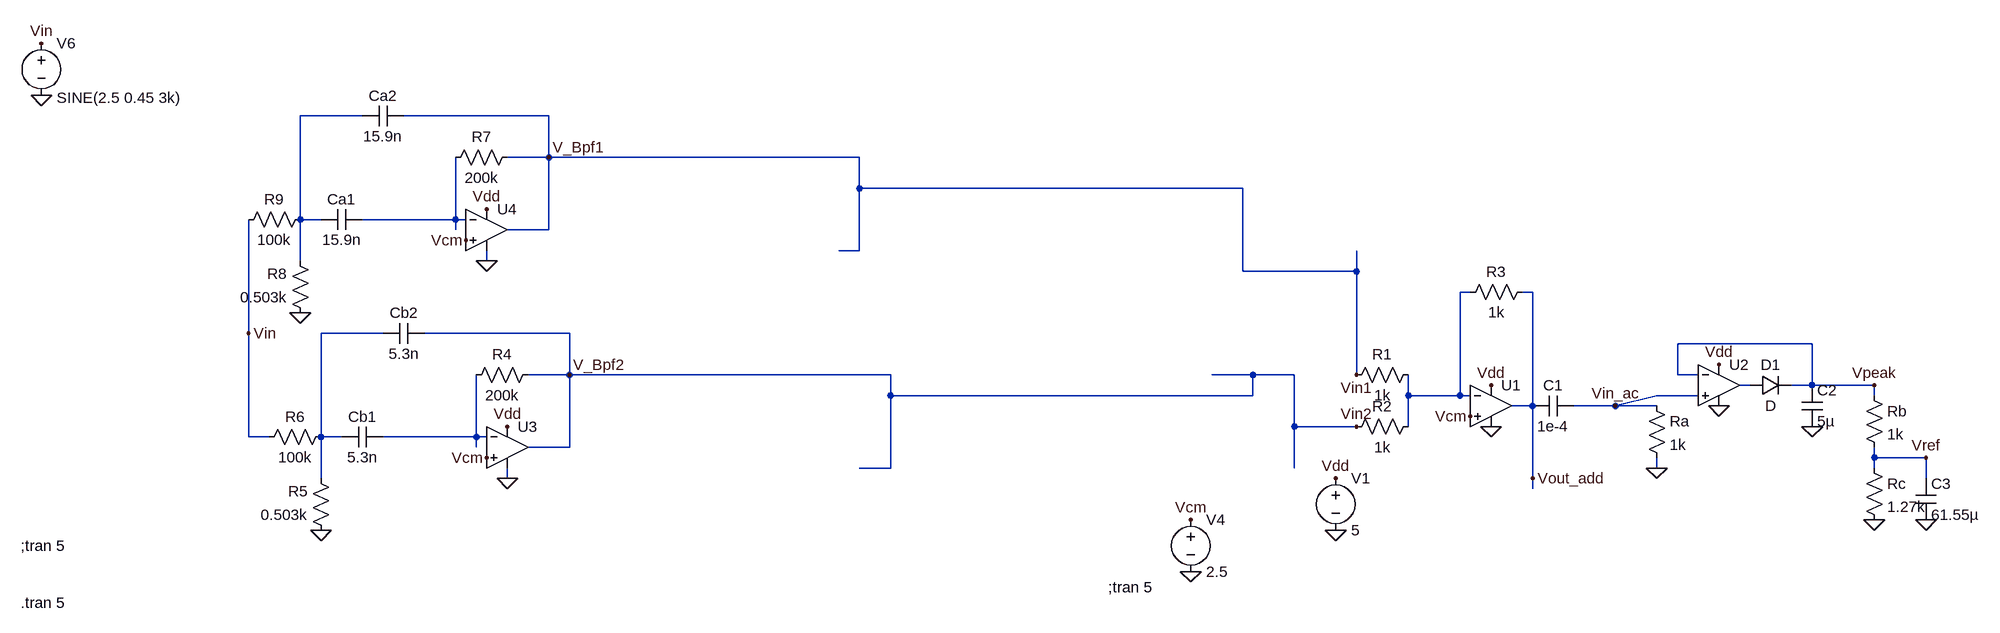
[diagram p0: schematic EE18B155_Exp7.asc]
EE18B155_Exp7.asc, the LTspice schematic file:
Version 4
SHEET 1 992 680
WIRE -1520 -352 -1616 -352
WIRE -1232 -352 -1456 -352
WIRE -1232 -288 -1232 -352
WIRE -1232 -288 -1296 -288
WIRE -752 -288 -1232 -288
WIRE -752 -240 -752 -288
WIRE -160 -240 -752 -240
WIRE -1616 -192 -1616 -352
WIRE -1584 -192 -1616 -192
WIRE -1376 -192 -1376 -288
WIRE -1376 -192 -1520 -192
WIRE -1360 -192 -1376 -192
WIRE -1376 -176 -1376 -192
WIRE -1232 -176 -1232 -288
WIRE -1232 -176 -1296 -176
WIRE -752 -144 -752 -240
WIRE -752 -144 -784 -144
WIRE -1616 -128 -1616 -192
WIRE -1328 -128 -1328 -144
WIRE -160 -112 -160 -240
WIRE 16 -112 16 -144
WIRE 16 -112 -160 -112
WIRE 192 -80 176 -80
WIRE 288 -80 272 -80
WIRE -1696 -16 -1696 -192
WIRE -1488 -16 -1584 -16
WIRE -1200 -16 -1424 -16
WIRE 720 0 512 0
WIRE -1200 48 -1200 -16
WIRE -1200 48 -1264 48
WIRE -704 48 -1200 48
WIRE -144 48 -208 48
WIRE -80 48 -144 48
WIRE 16 48 16 -112
WIRE 512 48 512 0
WIRE 544 48 512 48
WIRE 624 64 608 64
WIRE 720 64 720 0
WIRE 720 64 688 64
WIRE 816 64 720 64
WIRE -704 80 -704 48
WIRE -144 80 -144 48
WIRE -144 80 -704 80
WIRE 96 80 96 48
WIRE 176 80 176 -80
WIRE 176 80 96 80
WIRE 192 80 176 80
WIRE 544 80 480 80
WIRE 816 80 816 64
WIRE 288 96 288 -80
WIRE 288 96 256 96
WIRE 416 96 480 80
WIRE 416 96 352 96
WIRE 480 96 416 96
WIRE -80 128 -80 48
WIRE 16 128 -80 128
WIRE 96 128 96 80
WIRE -1696 144 -1696 -16
WIRE -1664 144 -1696 144
WIRE -1584 144 -1584 -16
WIRE -1552 144 -1584 144
WIRE -1344 144 -1344 48
WIRE -1344 144 -1488 144
WIRE -1328 144 -1344 144
WIRE -1344 160 -1344 144
WIRE -1200 160 -1200 48
WIRE -1200 160 -1264 160
WIRE 816 176 816 160
WIRE 896 176 816 176
WIRE -704 192 -704 80
WIRE -704 192 -752 192
WIRE -80 192 -80 128
WIRE 480 192 480 176
WIRE 816 192 816 176
WIRE -1584 208 -1584 144
WIRE -1296 208 -1296 192
WIRE 288 208 288 96
WIRE 896 208 896 176
WIRE 288 224 288 208
FLAG 224 128 0
FLAG 16 48 Vin1
FLAG 16 128 Vin2
FLAG 192 112 Vcm
FLAG 480 192 0
FLAG 576 96 0
FLAG 816 272 0
FLAG 896 272 0
FLAG 720 128 0
FLAG 896 176 Vref
FLAG 224 64 Vdd
FLAG 576 32 Vdd
FLAG -16 288 0
FLAG -16 208 Vdd
FLAG -240 352 0
FLAG -240 272 Vcm
FLAG 416 96 Vin_ac
FLAG 288 208 Vout_add
FLAG 816 64 Vpeak
FLAG -1296 208 0
FLAG -1296 128 Vdd
FLAG -1328 176 Vcm
FLAG -1584 288 0
FLAG -1328 -128 0
FLAG -1328 -208 Vdd
FLAG -1360 -160 Vcm
FLAG -1616 -48 0
FLAG -1696 -16 Vin
FLAG -1232 -288 V_Bpf1
FLAG -1200 48 V_Bpf2
FLAG -2016 -384 0
FLAG -2016 -464 Vin
SYMBOL res 112 32 R90
WINDOW 0 0 56 VBottom 2
WINDOW 3 32 56 VTop 2
SYMATTR InstName R1
SYMATTR Value 1k
SYMBOL res 112 112 R90
WINDOW 0 0 56 VBottom 2
WINDOW 3 32 56 VTop 2
SYMATTR InstName R2
SYMATTR Value 1k
SYMBOL Opamps\\UniversalOpamp2 224 96 R0
SYMATTR InstName U1
SYMBOL res 288 -96 R90
WINDOW 0 0 56 VBottom 2
WINDOW 3 32 56 VTop 2
SYMATTR InstName R3
SYMATTR Value 1k
SYMBOL Opamps\\UniversalOpamp2 576 64 R0
SYMATTR InstName U2
SYMBOL res 464 80 R0
SYMATTR InstName Ra
SYMATTR Value 1k
SYMBOL cap 352 80 R90
WINDOW 0 0 32 VBottom 2
WINDOW 3 32 32 VTop 2
SYMATTR InstName C1
SYMATTR Value 1e-4
SYMBOL diode 624 80 R270
WINDOW 0 32 32 VTop 2
WINDOW 3 0 32 VBottom 2
SYMATTR InstName D1
SYMBOL cap 704 64 R0
SYMATTR InstName C2
SYMATTR Value 5µ
SYMBOL res 800 64 R0
SYMATTR InstName Rb
SYMATTR Value 1k
SYMBOL res 800 176 R0
SYMATTR InstName Rc
SYMATTR Value 1.27k
SYMBOL cap 880 208 R0
SYMATTR InstName C3
SYMATTR Value 61.55µ
SYMBOL voltage -16 192 R0
WINDOW 123 0 0 Left 2
WINDOW 39 0 0 Left 2
SYMATTR InstName V1
SYMATTR Value 5
SYMBOL voltage -240 256 R0
WINDOW 123 0 0 Left 2
WINDOW 39 0 0 Left 2
SYMATTR InstName V4
SYMATTR Value 2.5
SYMBOL Opamps\\UniversalOpamp2 -1296 160 R0
SYMATTR InstName U3
SYMBOL res -1248 32 R90
WINDOW 0 0 56 VBottom 2
WINDOW 3 32 56 VTop 2
SYMATTR InstName R4
SYMATTR Value 200k
SYMBOL res -1568 304 R180
WINDOW 0 36 76 Left 2
WINDOW 3 36 40 Left 2
SYMATTR InstName R5
SYMATTR Value 0.503k
SYMBOL cap -1488 128 R90
WINDOW 0 0 32 VBottom 2
WINDOW 3 32 32 VTop 2
SYMATTR InstName Cb1
SYMATTR Value 5.3n
SYMBOL cap -1424 -32 R90
WINDOW 0 0 32 VBottom 2
WINDOW 3 32 32 VTop 2
SYMATTR InstName Cb2
SYMATTR Value 5.3n
SYMBOL res -1568 128 R90
WINDOW 0 0 56 VBottom 2
WINDOW 3 32 56 VTop 2
SYMATTR InstName R6
SYMATTR Value 100k
SYMBOL Opamps\\UniversalOpamp2 -1328 -176 R0
SYMATTR InstName U4
SYMBOL res -1280 -304 R90
WINDOW 0 0 56 VBottom 2
WINDOW 3 32 56 VTop 2
SYMATTR InstName R7
SYMATTR Value 200k
SYMBOL res -1600 -32 R180
WINDOW 0 36 76 Left 2
WINDOW 3 36 40 Left 2
SYMATTR InstName R8
SYMATTR Value 0.503k
SYMBOL cap -1520 -208 R90
WINDOW 0 0 32 VBottom 2
WINDOW 3 32 32 VTop 2
SYMATTR InstName Ca1
SYMATTR Value 15.9n
SYMBOL cap -1456 -368 R90
WINDOW 0 0 32 VBottom 2
WINDOW 3 32 32 VTop 2
SYMATTR InstName Ca2
SYMATTR Value 15.9n
SYMBOL res -1600 -208 R90
WINDOW 0 0 56 VBottom 2
WINDOW 3 32 56 VTop 2
SYMATTR InstName R9
SYMATTR Value 100k
SYMBOL voltage -2016 -480 R0
WINDOW 3 24 100 Left 2
WINDOW 123 24 72 Left 2
WINDOW 39 0 0 Left 2
SYMATTR Value SINE(2.5 0.45 3k)
SYMATTR InstName V6
TEXT -368 376 Left 2 !;tran 5
TEXT -2048 312 Left 2 !;tran 5
TEXT -2048 400 Left 2 !.tran 5

The netlist it stands for:
* EE18B155_Exp7.asc
R1 N003 V_Bpf1 1k
R2 N003 V_Bpf2 1k
XU1 Vcm N003 Vdd 0 Vout_add level.2 Avol=1Meg GBW=10Meg Slew=10Meg ilimit=25m rail=0 Vos=0 phimargin=45 en=0 enk=0 in=0 ink=0 Rin=500Meg  ; pins IN+ IN- V+ V- OUT
R3 Vout_add N003 1k
XU2 Vin_ac Vpeak Vdd 0 N005 level.2 Avol=1Meg GBW=10Meg Slew=10Meg ilimit=25m rail=0 Vos=0 phimargin=45 en=0 enk=0 in=0 ink=0 Rin=500Meg  ; pins IN+ IN- V+ V- OUT
Ra Vin_ac 0 1k
C1 Vin_ac Vout_add 1e-4
D1 N005 Vpeak D
C2 Vpeak 0 5µ
Rb Vpeak Vref 1k
Rc Vref 0 1.27k
C3 Vref 0 61.55µ
V1 Vdd 0 5
V4 Vcm 0 2.5
XU3 Vcm N006 Vdd 0 V_Bpf2 level.2 Avol=1Meg GBW=10Meg Slew=10Meg ilimit=25m rail=0 Vos=0 phimargin=45 en=0 enk=0 in=0 ink=0 Rin=500Meg  ; pins IN+ IN- V+ V- OUT
R4 V_Bpf2 N006 200k
R5 0 N004 0.503k
Cb1 N006 N004 5.3n
Cb2 V_Bpf2 N004 5.3n
R6 N004 Vin 100k
XU4 Vcm N002 Vdd 0 V_Bpf1 level.2 Avol=1Meg GBW=10Meg Slew=10Meg ilimit=25m rail=0 Vos=0 phimargin=45 en=0 enk=0 in=0 ink=0 Rin=500Meg  ; pins IN+ IN- V+ V- OUT
R7 V_Bpf1 N002 200k
R8 0 N001 0.503k
Ca1 N002 N001 15.9n
Ca2 V_Bpf1 N001 15.9n
R9 N001 Vin 100k
V6 Vin 0 SINE(2.5 0.45 3k)
.model D D
.lib standard.dio
;tran 5
;tran 5
.tran 5
.lib UniversalOpamps2.sub
.backanno
.end